# EAGLE design interfacez_vgaaudio_r2_0 (EAGLE 6.4)
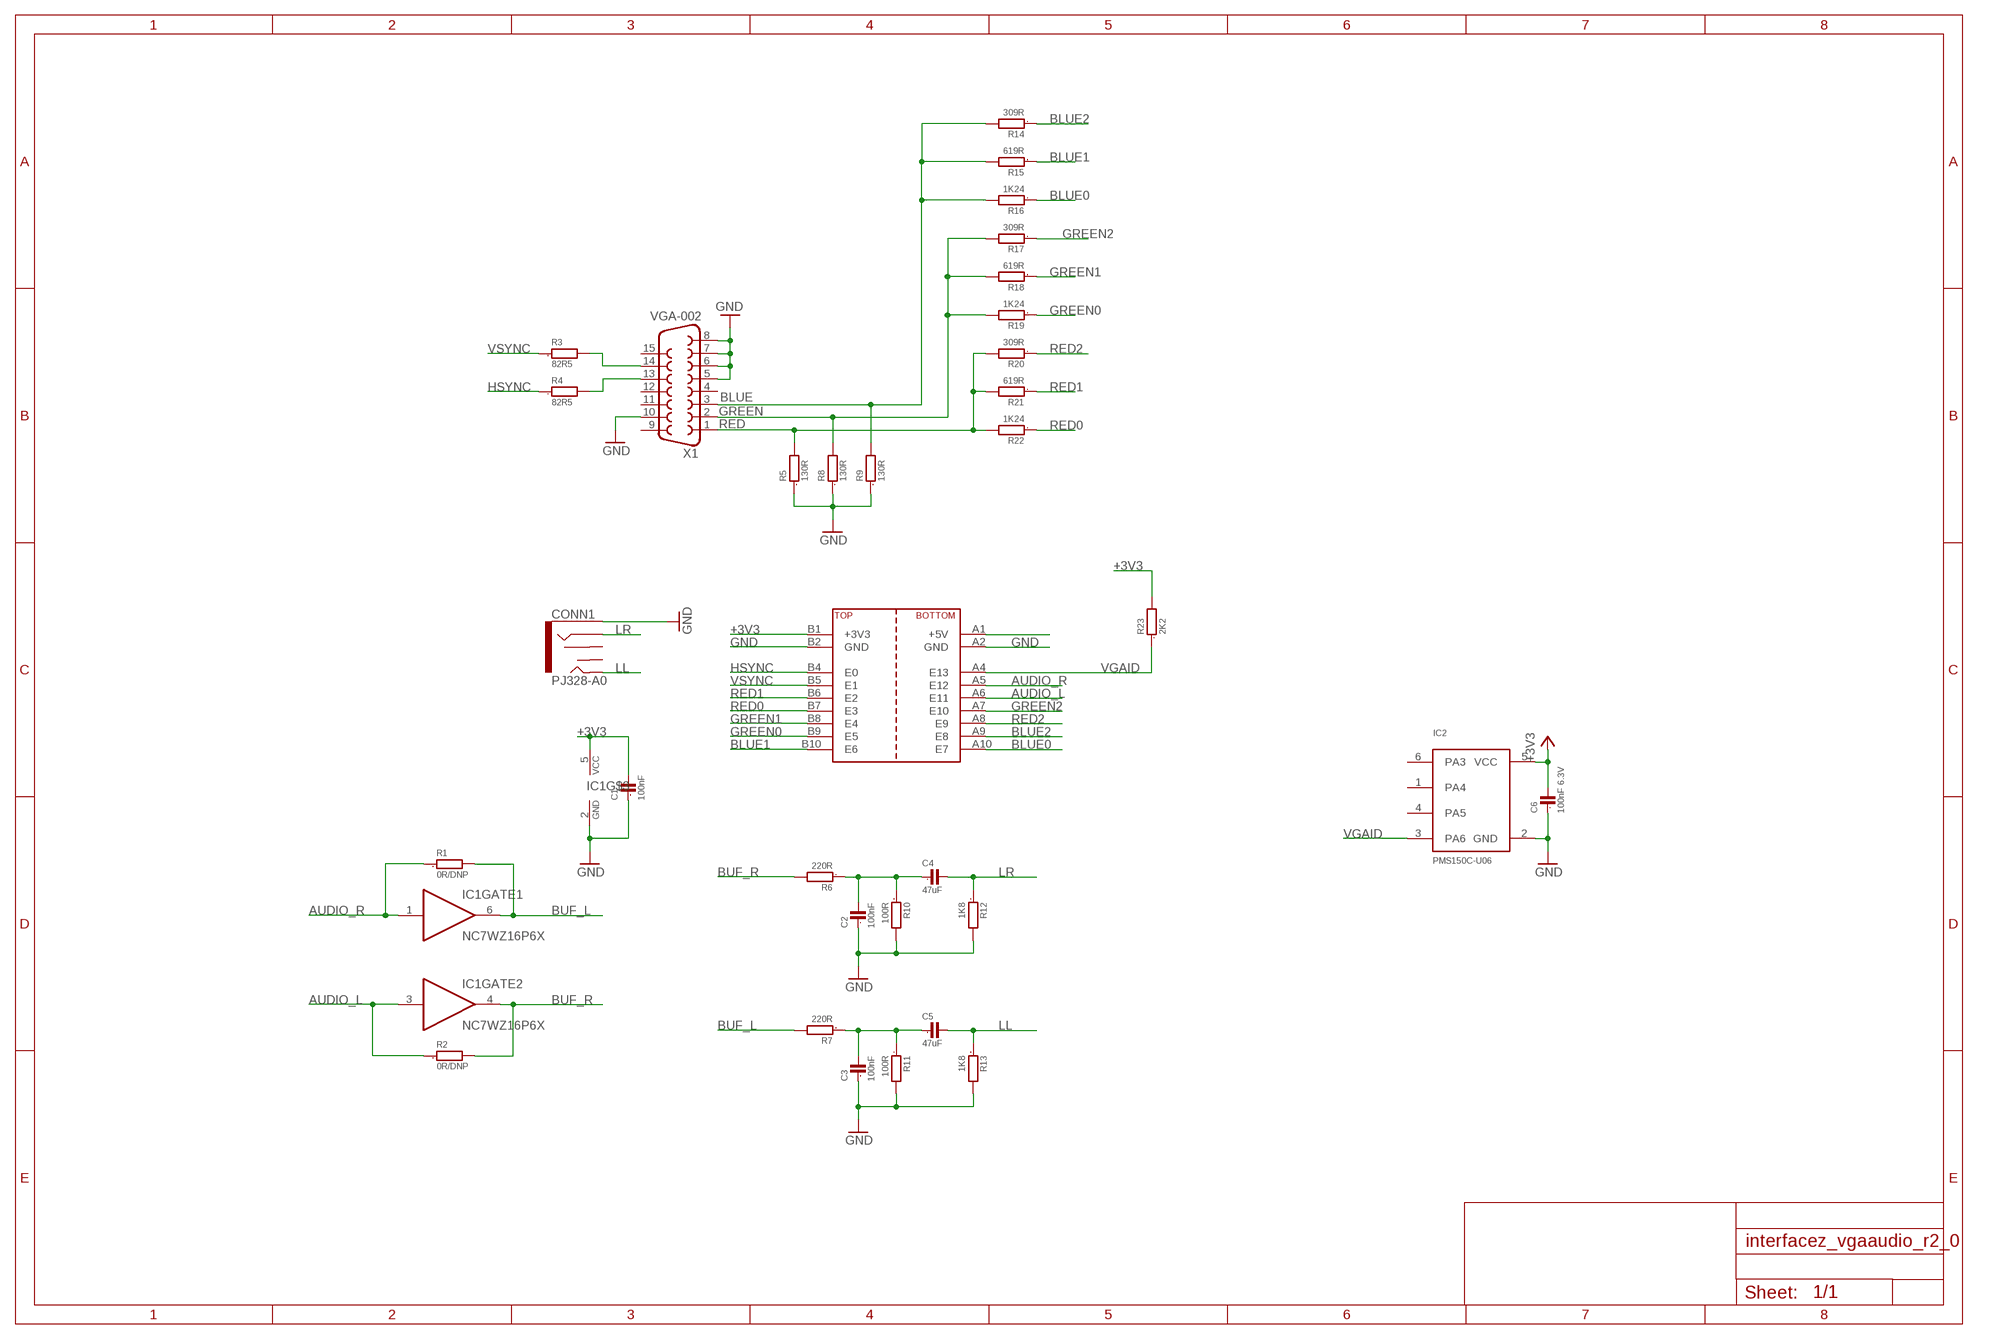
[diagram p0: schematic, sheet 1]

## Parts
C1  100nF  C0603  [0603]
C2  100nF  C0603  [0603]
C3  100nF  C0603  [0603]
C4  47uF  C1206  [1206]
C5  47uF  C1206  [1206]
C6  100nF 6.3V  C0603  [0603]
CONN1  PJ328-A0  [PJ328A0]
IC1  NC7WZ16P6X  NC7WZ07P6X  [SC70-6]
IC2  PMS150C-U06  [SOT23-6]
R1  0R/DNP  R0603  [0603]
R2  0R/DNP  R0603  [0603]
R3  82R5  R0603  [0603]
R4  82R5  R0603  [0603]
R5  130R  R0603  [0603]
R6  220R  R0603  [0603]
R7  220R  R0603  [0603]
R8  130R  R0603  [0603]
R9  130R  R0603  [0603]
R10  100R  R0603  [0603]
R11  100R  R0603  [0603]
R12  1K8  R0603  [0603]
R13  1K8  R0603  [0603]
R14  309R  R0603  [0603]
R15  619R  R0603  [0603]
R16  1K24  R0603  [0603]
R17  309R  R0603  [0603]
R18  619R  R0603  [0603]
R19  1K24  R0603  [0603]
R20  309R  R0603  [0603]
R21  619R  R0603  [0603]
R22  1K24  R0603  [0603]
R23  2K2  R0603  [0603]
U$1  INTERFACEZ_EDGEDAUGHTER  [INTERFACEZ_EXPANSION_DAUGHTERCARD]
X1  VGA-002  F15HDH  [HDF15H]

## Nets
+3V3: C1.2 C6.2 IC1.5(VCC) IC2.5(VCC) R23.2 U$1.B1(+3V3)
AUDIO_L: IC1.3(GATE2:I) R2.1 U$1.A6(E11)
AUDIO_R: IC1.1(GATE1:I) R1.1 U$1.A5(E12)
BLUE: R9.2 R14.2 R15.2 R16.2 X1.3
BLUE0: R16.1 U$1.A10(E7)
BLUE1: R15.1 U$1.B10(E6)
BLUE2: R14.1 U$1.A9(E8)
BUF_L: IC1.6(GATE1:O) R1.2 R7.2
BUF_R: IC1.4(GATE2:O) R2.2 R6.2
GND: C1.1 C2.1 C3.1 C6.1 CONN1.1(SLEEVE) IC1.2(GND) IC2.2(GND) R5.1 R8.1 R9.1 R10.2 R11.2 R12.2 R13.2 U$1.A2(GND) U$1.B2(GND) X1.5 X1.6 X1.7 X1.8 X1.10
GREEN: R8.2 R17.2 R18.2 R19.2 X1.2
GREEN0: R19.1 U$1.B9(E5)
GREEN1: R18.1 U$1.B8(E4)
GREEN2: R17.1 U$1.A7(E10)
HSYNC: R4.1 U$1.B4(E0)
LL: C5.2 CONN1.2(TIP) R13.1
LR: C4.2 CONN1.3(RING) R12.1
N$5: R4.2 X1.13
N$6: R3.2 X1.14
N$55: U$1.A1(+5V)
N$67: C3.2 C5.1 R7.1 R11.1
N$68: C2.2 C4.1 R6.1 R10.1
RED: R5.2 R20.2 R21.2 R22.2 X1.1
RED0: R22.1 U$1.B7(E3)
RED1: R21.1 U$1.B6(E2)
RED2: R20.1 U$1.A8(E9)
VGAID: IC2.3(PA6) R23.1 U$1.A4(E13)
VSYNC: R3.1 U$1.B5(E1)
Unconnected: CONN1.10(TSH) CONN1.11(RSH) IC2.1(PA4) IC2.4(PA5) IC2.6(PA3) X1.4 X1.9 X1.11 X1.12 X1.15

## Library data of the parts
C1-C6 = GadgetFactory:C: CAPACITOR, European symbol
CONN1 = alvie:PJ328-A0
IC1 = GadgetFactory:NC7WZ07P6X: Dual line drivers with 3-state outputs.
IC2 = alvie:PMS150C-U06
R1-R23 = GadgetFactory:R: RESISTOR, European symbol
U$1 = alvie:INTERFACEZ_EDGE
X1 = con-subd:F15: SUB-D; OC_FARNELL: unknown; OC_NEWARK: unknown

## Board
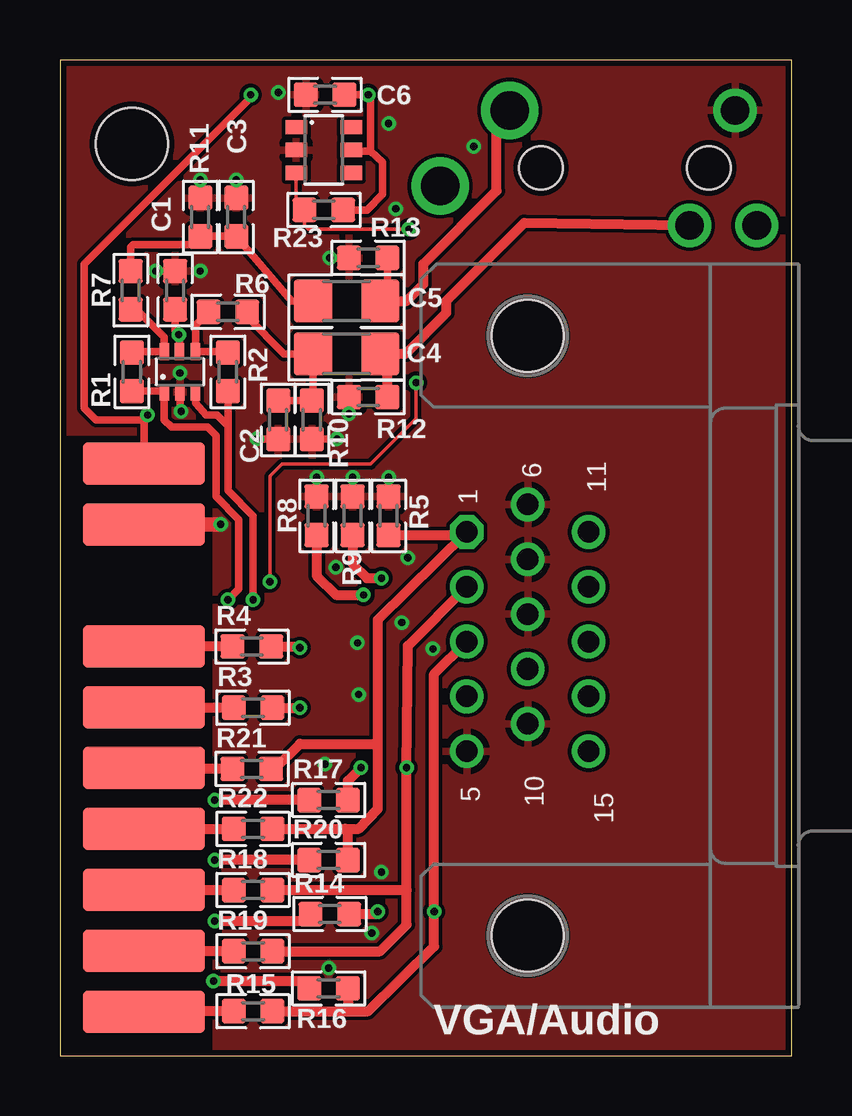
[diagram p1: board, top side]
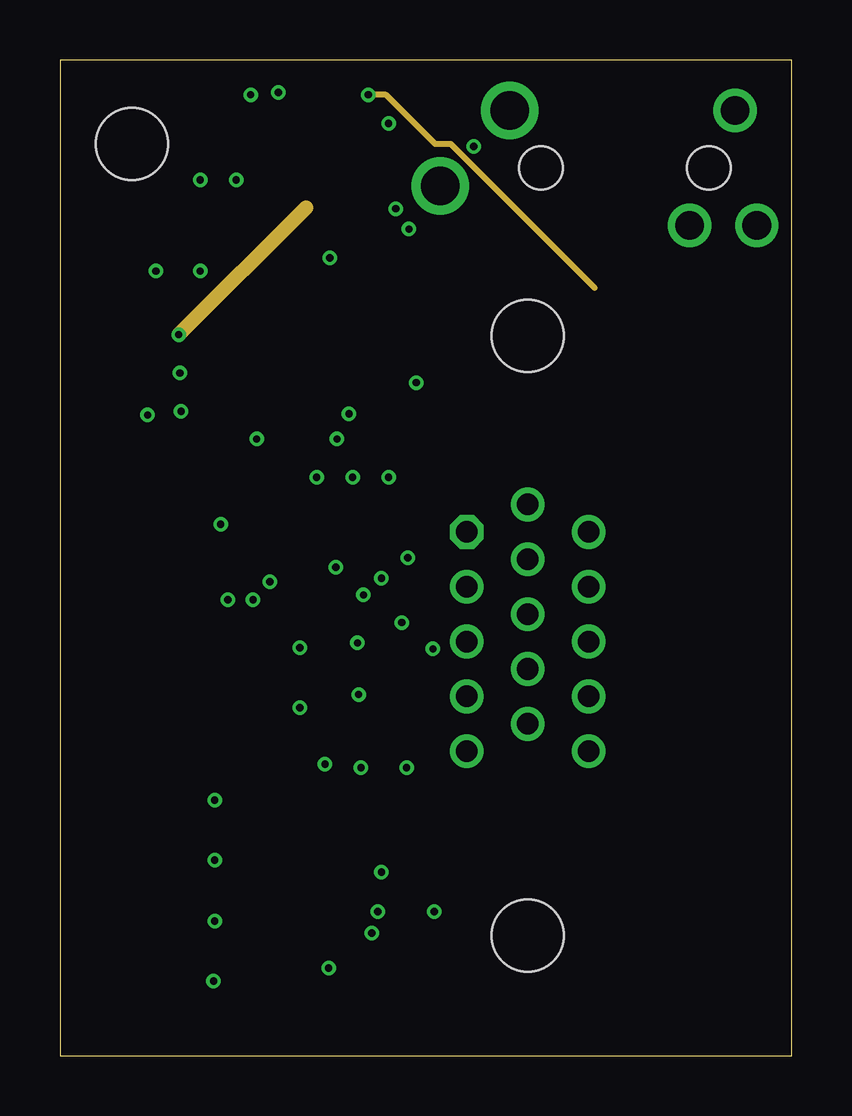
[diagram p2: board, inner layer Route2]
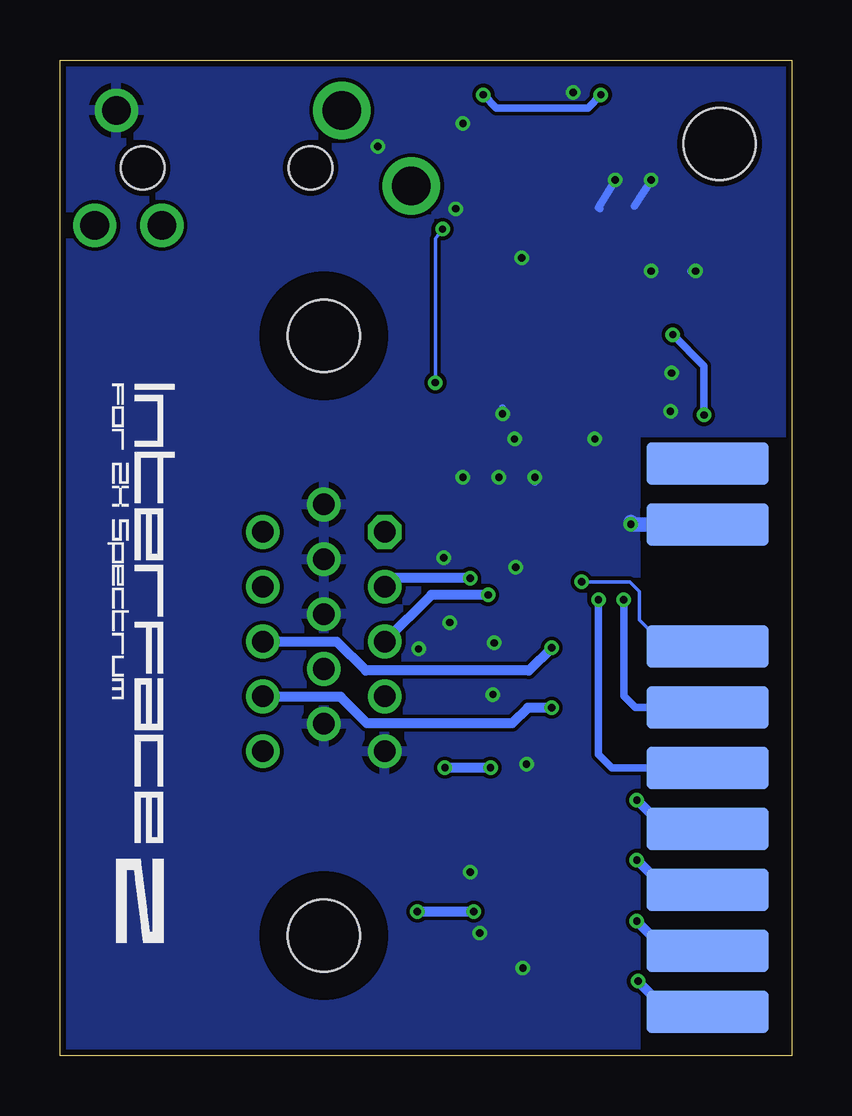
[diagram p3: board, bottom side, seen from below]

Size 30.5 x 41.5 mm. Coordinates in mm from the lower left corner, seen from the top.
Outline: 0,41.5 0,0 30.5,0 30.5,41.5 0,41.5
Copper layers (1*2*16): Top 0.035mm / dielectric 1.5mm / Route2 0.0175mm / dielectric 1.1mm / Bottom 0.035mm
Design rules "JLCPCB-Single-DualLayer *": minimum track width 5mil, minimum drill 0.3mm, track to track 6mil, track to pad 6mil, pad to pad 6mil, via to via 6mil, smd to smd 0mil, copper to edge 10mil, drill to drill 10mil, minimum pad ring 10mil, minimum via ring 6mil, stop-mask expansion 2mil, vias tented up to drill 100mil, thermal gap 10mil
Holes 3 mm at 3,38

### Footprints (pad centres in the part's own frame; a part is rotated, then mirrored left to right if it is on the bottom)
0603 = smd 1 x 1: 1 -0.8,0; 2 0.8,0
1206 = smd 1.6 x 1.8: 1 -1.4,0; 2 1.4,0
PJ328A0 = drill 1.2: 1 -4.95,-2.4; 3 -3.05,2.4; 11 -5.85,2.4 | drill 1.6: 2 4.45,-2.4; 10 7.35,0.75 | hole 1.8: -3.85,0; 3.15,0
SC70-6 = smd 0.4 x 0.7: 1 -0.65,-0.85; 2 0,-0.85; 3 0.65,-0.85; 4 0.65,0.85; 5 -0.015,0.85; 6 -0.65,0.85
SOT23-6 = smd 0.6 x 0.9: 1 -0.95,-1.15; 2 0,-1.15; 3 0.95,-1.15; 4 0.95,1.15; 5 0,1.15; 6 -0.95,1.15
INTERFACEZ_EXPANSION_DAUGHTERCARD = smd 1.778 x 5.08 bottom: A1 11.43,0; A2 8.89,0; A4 3.81,0; A5 1.27,0; A6 -1.27,0; A7 -3.81,0; A8 -6.35,0; A9 -8.89,0; A10 -11.43,0 | smd 1.778 x 5.08: B1 11.43,0; B2 8.89,0; B4 3.81,0; B5 1.27,0; B6 -1.27,0; B7 -3.81,0; B8 -6.35,0; B9 -8.89,0; B10 -11.43,0
HDF15H = drill 0.9 octagon: 1 4.329,2.54 | drill 0.9: 2 2.043,2.54; 3 -0.243,2.54; 4 -2.529,2.54; 5 -4.815,2.54; 6 5.472,0; 7 3.186,0; 8 0.9,0; 9 -1.386,0; 10 -3.672,0; 11 4.329,-2.54; 12 2.043,-2.54; 13 -0.243,-2.54; 14 -2.529,-2.54; 15 -4.815,-2.54 | hole 3: -12.5,0; 12.5,0

### Placement (x,y rotation side)
C1  4.8,31.9 270 top
C2  9.1,26.5 90 top
C3  7.35,34.95 270 top
C4  11.95,29.25 0 top
C5  11.95,31.45 0 top
C6  11.05,40.05 0 top
CONN1  23.2,37 180 top
IC1  5,28.5 0 top
IC2  11,37.75 270 top
R1  3,28.5 90 top
R2  7,28.5 90 top
R3  8.05,14.5 0 top
R4  8,17.05 0 top
R5  13.7,22.5 270 top
R6  7,31 180 top
R7  2.95,31.9 270 top
R8  12.2,22.5 270 top
R9  10.7,22.5 270 top
R10  10.5,26.5 270 top
R11  5.85,34.95 90 top
R12  12.85,27.45 180 top
R13  12.85,33.25 180 top
R14  11.25,5.9 0 top
R15  8.05,1.85 0 top
R16  11.2,2.8 0 top
R17  11.2,10.65 0 top
R18  8.05,6.9 0 top
R19  8.05,4.35 0 top
R20  11.2,8.15 0 top
R21  8,11.95 0 top
R22  8.05,9.45 0 top
R23  11,35.25 0 top
U$1  3.5,13.25 90 top
U$14  [LOGO-23-2.65]  28.5,28 270 bottom
X1  19.5,17.5 90 top

### Tracks (layer width: path | path; a pad name or v marks a point on that pad's centre or on a via)
+3V3  (via drill 0.3)
  Top 0.305: IC1.5 4.99,30.02 v4.95,30.05 4.8,30.2 C1.2 | U$1.B1 3.5,26.55 v3.65,26.7 3.45,26.5 1.5,26.5 1,27 1,33 8,40 v7.95,40.05 | R23.2 12.8,35.25 13.45,35.9 13.45,37.25 12.95,37.7 | IC2.5 12.2,37.7 12.95,37.7 | C6.2 v12.85,40.05 12.95,39.9 12.95,37.7
  Route2 0.254: 22.3,32 16.3,38 15.65,38 13.6,40.05 v12.85,40.05
  Route2 0.61: 10.25,35.35 v4.95,30.05
  Bottom 0.305: v3.65,26.7 3.65,28.75 v4.95,30.05 | v12.85,40.05 12.3,39.5 8.5,39.5 v7.95,40.05
AUDIO_L  (via drill 0.3)
  Top 0.305: v8.05,19 8.05,22.5 7,23.55 7,26.25 | 7,26.25 6.55,26.7 6.1,26.7 5.65,27.2 IC1.3 | R2.1 7,26.25
  Bottom 0.305: U$1.A6 7.48,11.98 8.05,12.55 v8.05,19
AUDIO_R  (via drill 0.3)
  Top 0.305: v7,19 7.45,19.45 7.45,22.35 6.5,23.3 6.5,25.8 6.5,25.85 6.15,26.2 4.65,26.2 4.35,26.5 IC1.1 4.3,27.7 R1.1
  Bottom 0.305: U$1.A5 6.52,14.52 7,15 v7,19
BLUE  (via drill 0.3)
  Top 0.406: R15.2 12,1.85 | 12,1.85 12.85,1.85 15.6,4.55 v15.6,6 15.6,15.9 X1.3 | R14.2 13.1,5.9 v13.25,6 | R9.2 10.7,20 11.5,19.2 v12.65,19.2 | R16.2 12,1.85
  Bottom 0.406: v13.25,6 v15.6,6 | v12.65,19.2 15.02,19.2 X1.3
BLUE0  (via drill 0.3)
  Top 0.406: R16.1 10.4,3.05 10.35,3.1 v6.4,3.1
  Bottom 0.305: 5.2,1.9 3.58,1.9 U$1.A10
  Bottom 0.406: v6.4,3.1 5.2,1.9
BLUE1
  Top 0.406: R15.1 3.53,1.85 U$1.B10
BLUE2  (via drill 0.3)
  Top 0.406: R14.1 10.4,5.9 10.1,5.6 v6.45,5.6
  Bottom 0.305: 5.15,4.3 3.56,4.3 U$1.A9
  Bottom 0.406: v6.45,5.6 5.15,4.3
BUF_L
  Top 0.305: R1.2 3.05,29.35 IC1.6 4.35,29.95 3.2,31.1 R7.2
BUF_R
  Top 0.305: R2.2 6.95,29.35 IC1.4 5.65,30.45 R6.2
GND  (via drill 0.3)
  Top 0.305: IC1.2 5,26.9 v5.05,26.85 | C1.1 v4,32.7 | R11.2 v5.85,36.5 | C3.1 v7.35,36.5 | R12.2 v12.05,26.75 | R10.2 v11.55,25.7 | C2.1 v8.2,25.7 | R9.1 v10.7,24.1 | R8.1 v12.2,24.1 | R5.1 v13.7,24.1 | R13.2 v11.25,33.25
  Top 0.61: U$1.A2 v6.69,22.14 v6.7,22.15
  Bottom 0.305: v5.05,26.85 5.05,26.9 5,26.95 | v4,32.7 4.2,32.7 | v5.85,36.5 6.55,35.4 | v7.35,36.5 8.05,35.35 8,35.3 | v12.05,26.75 12.05,27 | v11.55,25.7 11.5,25.7 | v10.7,24.1 10.7,23.9 | v12.2,24.1 12.2,24 | v13.7,24.1 13.7,24.05 | v11.25,33.25 11.35,33.25
  Bottom 0.61: 6.7,22.25 v6.7,22.15 v6.69,22.14 U$1.A2
  other vias: 5,28.45 13.4,7.65 13,5.1 11.2,3.65 14.25,18.05 15.55,16.95 12.4,17.2 12.45,15.05 11.05,12.15 14.5,20.75 11.5,20.35 5.85,32.7 14,35.3 17.25,37.9 13.7,38.85 9.1,40.15
  pour Bottom: 0,41.5 30.5,41.5 30.5,0 6.5,0 6.5,26 0,26
  pour Top: 0,41.5 30.5,41.5 30.5,0 6.5,0 6.5,26 0,26
GREEN  (via drill 0.3)
  Top 0.406: R19.2 13.35,4.35 14.45,5.45 14.45,6.9 | 14.45,6.9 v14.45,12 14.5,17.08 X1.2 | R17.2 12,11.45 v12.55,12 | R8.2 12.2,20.5 12.8,19.9 v13.4,19.9 | R18.2 14.45,6.9
  Bottom 0.406: v12.55,12 v14.45,12 | v13.4,19.9 16.6,19.9 X1.2
GREEN0
  Top 0.406: U$1.B9 R19.1
GREEN1
  Top 0.406: U$1.B8 R18.1
GREEN2  (via drill 0.3)
  Top 0.406: R17.1 v6.45,10.65
  Bottom 0.305: 5.2,9.4 3.54,9.4 U$1.A7
  Bottom 0.406: v6.45,10.65 5.2,9.4
HSYNC
  Top 0.406: R4.1 U$1.B4
LL
  Top 0.305: R13.1 13.65,31.75 C5.2
  Top 0.406: C5.2 14.45,31.45 15.15,32.15 15.15,33 18.2,36.05 18.2,38.85 CONN1.2
LR
  Top 0.406: CONN1.3 19.35,34.7 16.1,31.45 16.1,30.95 14.4,29.25 C4.2 13.65,28.95 R12.1
N$5  (via drill 0.3)
  Top 0.305: 9.95,17.05 v10,17
  Top 0.406: R4.2 9.95,17.05
  Bottom 0.305: X1.13
  Bottom 0.406: v10,17 10.95,16.05 17.75,16.05 18.95,17.25 X1.13
N$6  (via drill 0.3)
  Top 0.406: R3.2 v10,14.5
  Bottom 0.305: 22.02,14.95 X1.14
  Bottom 0.406: v10,14.5 11,14.5 11.65,13.85 17.7,13.85 18.8,14.95 22.02,14.95
N$67
  Top 0.305: C5.1 9.65,31.45 C3.2 R11.1 5.8,33.8 3.05,33.8 2.95,33.7 R7.1
N$68
  Top 0.305: C2.2 R10.1 10.55,27.35 C4.1 9.35,29.25 7.8,30.8 R6.1
RED
  Top 0.406: R22.2 11.9,9.45 | 11.9,9.45 12.45,9.45 13.25,10.3 13.25,13 | 13.25,13 13.25,18.17 X1.1 16.83,21.7 R5.2 | R20.2 12,9.35 11.9,9.45 | R21.2 8.95,11.95 10,13 13.25,13
RED0
  Top 0.406: U$1.B7 R22.1
RED1
  Top 0.406: R21.1 3.53,11.95 U$1.B6
RED2  (via drill 0.3)
  Top 0.406: R20.1 v6.45,8.15
  Bottom 0.305: 5.05,6.75 3.65,6.75 U$1.A8
  Bottom 0.406: v6.45,8.15 5.05,6.75
VGAID  (via drill 0.3)
  Top 0.152: v8.75,19.75 8.75,24.15 9.25,24.65 12.95,24.65 14.85,26.55 v14.85,28.05 | v14.55,34.45 10.35,34.45 10.2,34.6 R23.1 9.85,35.6 IC2.3
  Bottom 0.152: U$1.A4 5.26,17.06 6.35,18.15 6.35,19.35 6.75,19.75 v8.75,19.75 | v14.85,28.05 14.85,34.05 v14.55,34.45
VSYNC
  Top 0.406: R3.1 3.52,14.5 U$1.B5

### Text on the board
tPlace: VGA/Audio
bRework: CUT | CUT
tRework: CUT